# EAGLE design mod_mixer_no_led (EAGLE 7.2.0)
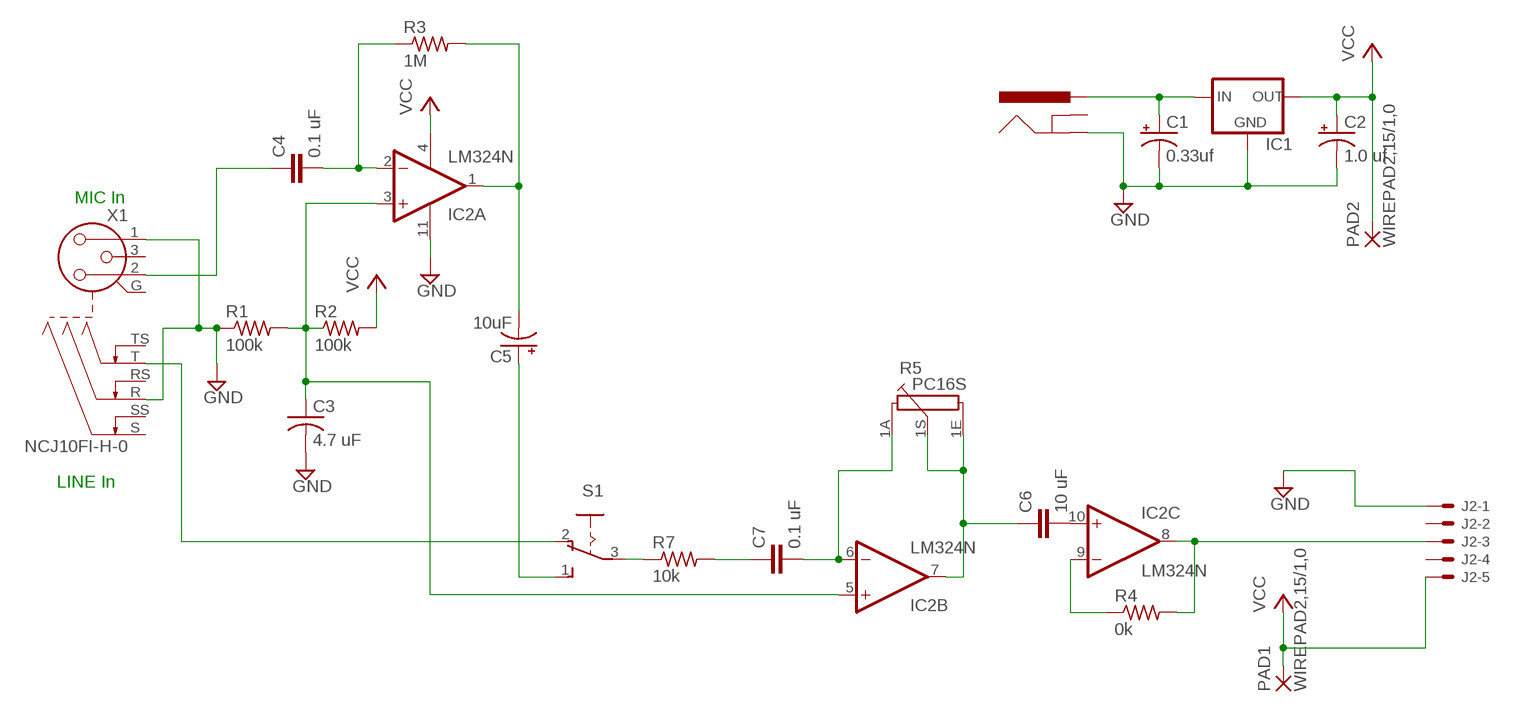
[diagram p0: schematic, sheet 1]

## Parts
C1  0.33uf  CPOL-USE2.5-6  [E2,5-6]
C2  1.0 uf  CPOL-USE2.5-6  [E2,5-6]
C3  4.7 uF  C-US050-030X075  [C050-030X075]
C4  0.1 uF  C5/2.5  [C5B2.5]
C5  10uF  CPOL-USE2.5-7  [E2,5-7]
C6  10 uF  C5/2.5  [C5B2.5]
C7  0.1 uF  C5/2.5  [C5B2.5]
IC1  V_REG_78XXSIDE  [78XXL]
IC2  LM324N  [DIL14]
J1  POWER_JACKSLT  [POWER_JACK_SLOT]
J2  CON-50-EDGE  [CARDEDGE-50]
PAD1  WIREPAD2,15/1,0  [2,15/1,0]
PAD2  WIREPAD2,15/1,0  [2,15/1,0]
R1  100k  R-US_0207/10  [0207/10]
R2  100k  R-US_0207/10  [0207/10]
R3  1M  R-US_0207/10  [0207/10]
R4  0k  R-US_0207/10  [0207/10]
R5  PC16S  [PC16S]
R7  10k  R-US_0207/10  [0207/10]
S1  255SB  [255SB]
X1  NCJ10FI-H-0  [NCJ10FI-H-0]

## Nets
GND: C1.- C2.- C3.2 IC1.GND IC2.11(P:V-) J1.GND@2(GND) J2.1 R1.1 X1.1 X1.R
N$1: C3.1 IC2.3(A:+IN) IC2.5(B:+IN) R1.2 R2.1
N$2: C1.+ IC1.IN J1.PWR
N$3: C7.1 R7.2
N$4: C4.2 IC2.2(A:-IN) R3.1
N$5: C7.2 IC2.6(B:-IN) R5.1A
N$7: C5.- IC2.1(A:OUT) R3.2
N$8: R7.1 S1.3(P)
N$9: S1.2(O) X1.T
N$10: C4.1 X1.2
N$11: C5.+ S1.1(S)
N$12: C6.2 IC2.10(C:+IN)
N$13: IC2.9(C:-IN) R4.1
N$14: IC2.8(C:OUT) J2.3 R4.2
N$15: C6.1 IC2.7(B:OUT) R5.1E R5.1S
VCC: C2.+ IC1.OUT IC2.4(P:V+) J2.5 PAD1.1(P) PAD2.1(P) R2.2
Unconnected: IC2.12(D:+IN) IC2.13(D:-IN) IC2.14(D:OUT) J1.GND@1(GNDBREAK) J2.2 J2.4 X1.3 X1.G X1.RS X1.S X1.SS X1.TS

## Notes on the sheet
- MIC In
- LINE In

## Library data of the parts
C1 C2 C5 = rcl:CPOL-US: POLARIZED CAPACITOR, American symbol
C3 = resistor:C-US: CAPACITOR, American symbol
C4 C6 C7 = capacitor-wima:C: CAPACITOR naming: grid - package width
IC1 = SparkFun:V_REG_78XX: Voltage Regulator Standard 7805 5V regulator. IGO (Input Ground Output). Spark Fun Electronics SKU : COM-00107
IC2 = linear:LM324: OP AMP
J1 = SparkFun:POWER_JACK: Power Jack This is the standard 5.5mm barrel jack for power. The PTH is the most common, proven, reliable, footprint. All others are experimental. The Slot footprint only works if the mill layer is transmitted to the PCB fab house so be warned. Spark Fun Electronics SKU : PRT-00119. Mating wall wart : TOL-00298 (and others)
J2 = card-edge_5pin:CON-50: Connector 5-pin
PAD1 PAD2 = wirepad:WIREPAD: Wire PAD connect wire on PCB
R1-R4 R7 = resistor:R-US_: RESISTOR, American symbol
R5 = piherUPDATE:PC16S: POTENTIOMETER single carbon potentiometer, 16 mm, S3ROH; OC_FARNELL: 4452940; OC_NEWARK: unknown
S1 = switchUPDATE:255SB: SLIDING SWITCH Distributor Buerklin, 11G810
X1 = con-neutrik_ag:NCJ10FI-: Neutrik Audio Connector XLR SERIES Stereo 1/4" jack with switch Source: www.neutrik.com/; MPN: NCJ10FI-H-0; OC_FARNELL: unknown; OC_NEWARK: 99B1398

## Board
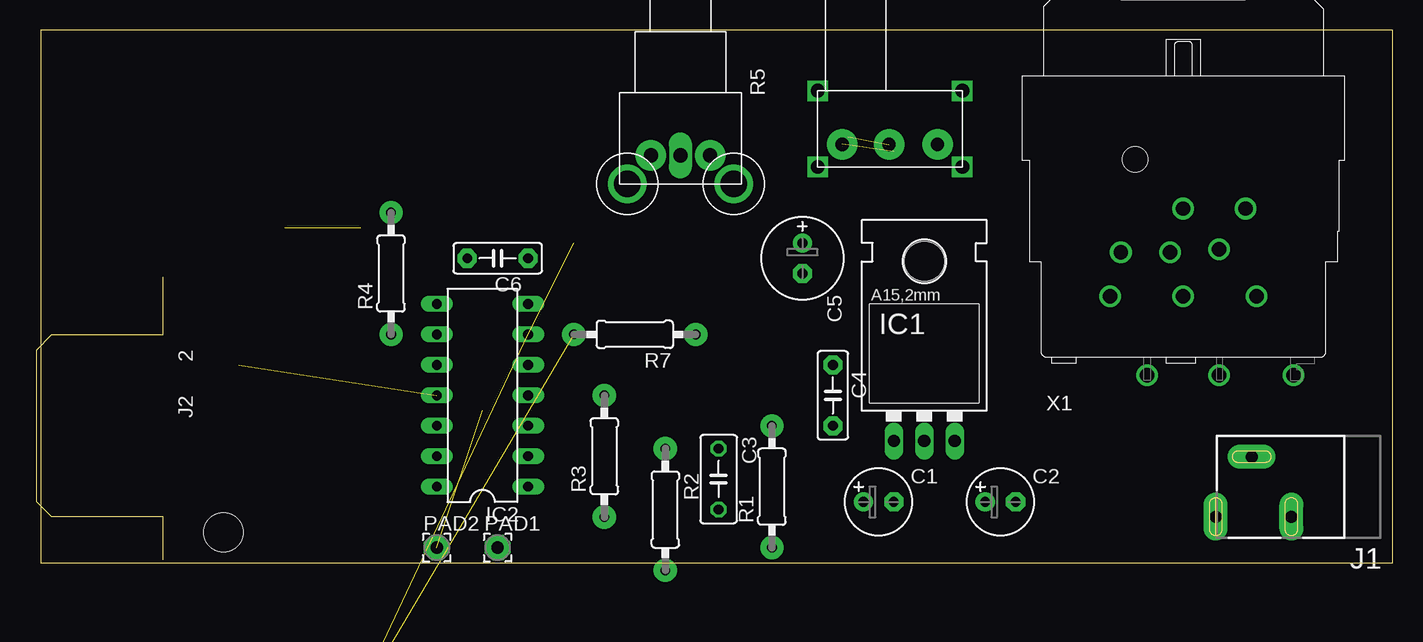
[diagram p1: board, top side]
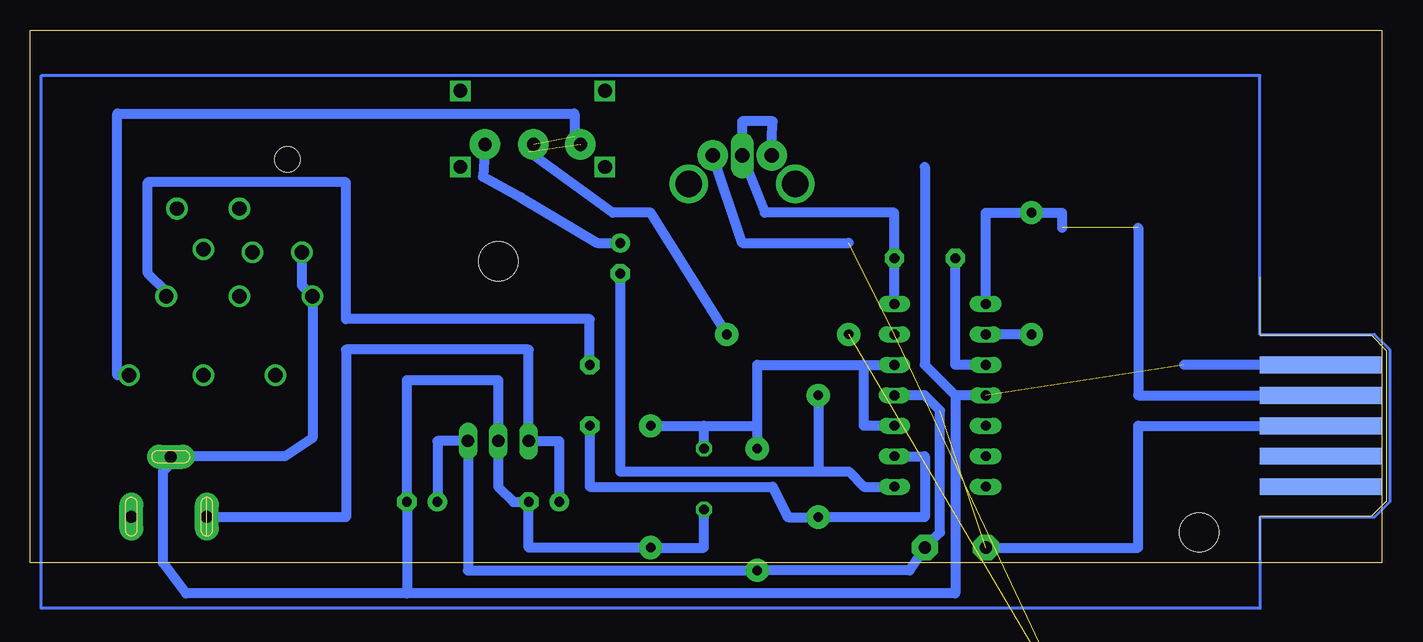
[diagram p2: board, bottom side, seen from below]

Size 112.7 x 44.44 mm. Coordinates in mm from the lower left corner, seen from the top.
Outline: 0,0 112.7,0 112.7,44.44 0,44.44 0,0
Copper layers (1*16): Top 0.035mm / dielectric 1.5mm / Bottom 0.035mm
Design rules "default": minimum track width 10mil, minimum drill 24mil, track to track 8mil, track to pad 8mil, pad to pad 8mil, via to via 8mil, smd to smd 8mil, copper to edge 40mil, drill to drill 8mil, minimum pad ring 10mil, minimum via ring 8mil, stop-mask expansion 4mil, vias tented up to drill 0mil, thermal gap 10mil
Holes 3.26 mm at 15.24,2.54

### Footprints (pad centres in the part's own frame; a part is rotated, then mirrored left to right if it is on the bottom)
E2,5-6 = drill 0.813 pad 1.6: + -1.27,0 | drill 0.813 pad 1.6 octagon: - 1.27,0
C050-030X075 = drill 0.813 octagon: 1 -2.54,0; 2 2.54,0
C5B2.5 = drill 0.813 pad 1.6 octagon: 1 -2.54,0; 2 2.54,0
E2,5-7 = drill 0.813 pad 1.6: + -1.27,0 | drill 0.813 pad 1.6 octagon: - 1.27,0
78XXL = drill 1.016 long: GND 0,-3.81; IN -2.54,-3.81; OUT 2.54,-3.81 | hole 3.302: 0,11.176
DIL14 = drill 0.813 long: 1 -7.62,-3.81; 2 -5.08,-3.81; 3 -2.54,-3.81; 4 0,-3.81; 5 2.54,-3.81; 6 5.08,-3.81; 7 7.62,-3.81; 8 7.62,3.81; 9 5.08,3.81; 10 2.54,3.81; 11 0,3.81; 12 -2.54,3.81; 13 -5.08,3.81; 14 -7.62,3.81
POWER_JACK_SLOT = drill 1 pad 2 long: GND@1 2.58,7.5; GND@2 7.58,10.8; PWR 2.58,13.8
CARDEDGE-50 = smd 1.397 x 10.16 bottom: 1 -30.48,5.08; 2 -30.48,5.08; 3 -27.94,5.08; 4 -27.94,5.08; 5 -25.4,5.08; 7 -22.86,5.08; 9 -20.32,5.08
2,15/1,0 = drill 1.016 pad 2.159 octagon: 1 0,0
0207/10 = drill 0.813 pad 1.93: 1 -5.08,0 | drill 0.8 pad 1.93: 2 5.08,0
PC16S = drill 1.2 pad 2.54: 1A 5,-7.77; 1E 0.08,-7.77 | drill 1.2 pad 1.93 long: 1S 2.54,-7.77 | drill 2.2 pad 3.175: P$1 6.985,-10.16; P$2 -1.905,-10.16
255SB = drill 1.1 pad 2.54: 1 3.01,-0.658; 2 -1.033,-0.663; 3 -4.939,-0.66 | drill 1.143 square: P$1 5.08,-2.54; P$2 -6.985,-2.54; P$5 5.08,3.81; P$6 -6.985,3.81
NCJ10FI-H-0 = drill 1.2: 1 -6.1,-18.4; 2 6.1,-18.4; 3 0,-18.4; G 0,-11.1; GN -1.1,-14.75; R -5.2,-14.75; RS -3,-25; S 5.2,-11.1; SS 3,-14.5; T 9.2,-25; TS 3,-25 | hole 2.1: -4,-7

### Placement (x,y rotation side)
C1  69.85,5.08 0 top
C2  80.01,5.08 0 top
C3  56.52,6.98 270 top
C4  66.04,13.97 270 top
C5  63.5,25.4 270 top
C6  38.1,25.4 180 top
C7  3.17,-55.25 0 top  (outside the outline)
IC1  73.66,13.97 0 top
IC2  36.83,13.97 90 top
J1  111.76,1.27 90 top
J2  0,-13.97 270 top
PAD1  38.1,1.27 0 top
PAD2  33.02,1.27 0 top
R1  60.96,6.35 90 top
R2  52.07,4.45 270 top
R3  46.99,8.89 90 top
R4  29.21,24.13 90 top
R5  50.8,41.76 0 top
R7  49.53,19.05 180 top
S1  71.75,35.56 0 top
X1  95.25,40.64 0 top

### Tracks (layer width: path | path; a pad name or v marks a point on that pad's centre or on a via)
GND  (1 unrouted)
  Bottom 0.813: X1.R 90.05,23.14 X1.1 89.15,10.41 91.44,8.89 100.33,8.89 | C3.2 56.52,1.27 R1.1 71.12,1.27 C1.- 72.39,5.08 73.66,6.35 IC1.GND 73.66,15.24 81.28,15.24 C2.- 81.28,-2.54 | 100.33,8.89 100.92,8.89 J1.GND@2 | IC2.11 35.56,13.97 | 35.56,13.97 35.56,-2.54 81.28,-2.54 | 81.28,-2.54 99.69,-2.54 101.6,0 101.6,7.62 100.33,8.89 | 38.1,33.02 38.1,16.51 35.56,13.97 | J2.1 16.51,16.51
N$1
  Bottom 0.813: IC2.3 43.18,11.43 43.18,16.51 | 43.18,16.51 IC2.5 | R2.1 52.07,11.43 | 52.07,11.43 52.07,16.51 43.18,16.51 | R1.2 56.52,11.43 | 56.52,11.43 52.07,11.43 | C3.1 56.52,11.43
N$2
  Bottom 0.813: J1.PWR 97.96,3.81 86.36,3.81 86.36,17.78 71.12,17.78 IC1.IN 68.58,10.16 C1.+
N$3  (1 unrouted)
N$4
  Bottom 0.813: IC2.2 38.1,8.89 38.1,3.81 R3.1 49.53,3.81 50.8,6.35 66.04,6.35 C4.2
N$5  (2 unrouted)
  Bottom 0.813: R5.1A 53.34,26.67 44.45,26.67
N$6
  Bottom 0.254: 10.16,19.05 0.63,19.05 -0.63,17.78 -0.63,5.08 0.63,3.81 10.16,3.81 10.16,-3.81 111.76,-3.81 111.76,40.64 10.16,40.64 10.16,19.05
N$7
  Bottom 0.813: 46.99,7.62 63.5,7.62 C5.- | 46.99,7.62 44.45,7.62 43.18,6.35 IC2.1 | R3.2 46.99,7.62
N$8  (1 unrouted)
  Bottom 0.813: R7.1 60.96,29.21 64.14,29.21 71.12,34.29
N$9  (1 unrouted)
  Bottom 0.813: X1.T 105.41,15.64 105.41,37.46 67.31,37.46 67.31,35.56
N$10
  Bottom 0.813: X1.2 101.35,22.61 102.87,24.13 102.87,31.75 86.36,31.75 86.36,20.32 66.04,20.32 C4.1
N$11
  Bottom 0.813: S1.1 74.93,32.2 71.75,30.48 65.41,26.67 C5.+
N$12
  Bottom 0.813: IC2.10 35.56,16.51 C6.2
N$13
  Bottom 0.813: R4.1 IC2.9
N$14  (1 unrouted)
  Bottom 0.813: IC2.8 33.02,29.21 R4.2 26.67,29.21 26.67,27.94 | 20.32,27.94 20.32,13.97 J2.3
N$15
  Bottom 0.813: IC2.7 C6.1 40.64,29.21 51.43,29.21 R5.1S 53.34,36.83 50.8,36.83 50.8,36.76 R5.1E
VCC  (1 unrouted)
  Bottom 0.813: C2.+ 78.74,10.16 IC1.OUT 76.2,-0.64 R2.2 39.37,-0.64 PAD1.1 36.83,2.54 36.83,12.7 38.1,13.97 IC2.4 | PAD2.1 20.32,1.27 20.32,11.43 J2.5